# Altium project TASK1AE.PrjPcb
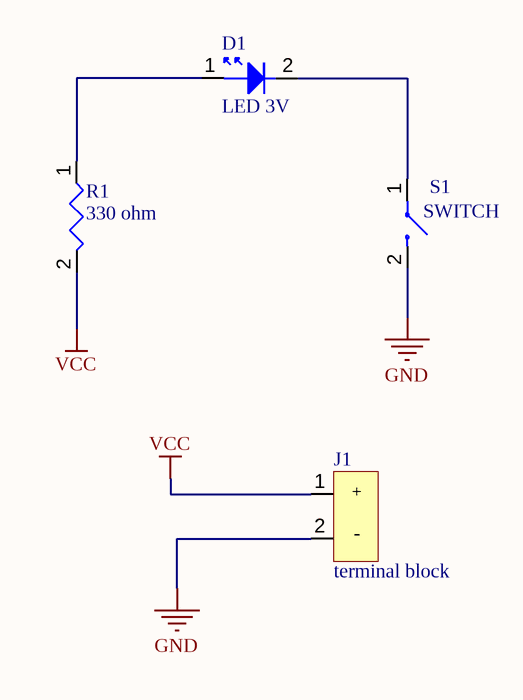
[diagram p0: circuit page19.SchDoc]
CAGE_CODE: ?????; CONTRACT_NUMBER: <CONTRACT NO>; DOC_NO_ASSY_DWG: <ASSY DWG NO>; DOC_NO_BOM: <BOM DOC NO>; DOC_NO_FAB_DWG: <FAB DWG NO>; DOC_NO_SCH_DWG: <SCH DWG NO>; PCB_2_DEC_TOL: +/-.01; PCB_3_DEC_TOL: +/-.010; PCB_ANG_TOL: +/-1/2; PCB_ASSEMBLY_NO: <PCB ASSY NO>; PCB_CHECKER: - -----; PCB_CHECKER_APP_DATE: --/--/----; PCB_DESIGNER: - -----; PCB_DESIGNER_APP_DATE: --/--/----; PCB_DWG_NO: <PCB DWG NO>; PCB_ENGINEER: - -----; PCB_ENGINEER_APP_DATE: --/--/----; PCB_PART_NUMBER: <PCB PN>; PCB_REV: A; SCH_REV: A
2 sheets, 10 parts. Net scope: global (net labels, ports and power ports of the same name join across sheets).
Board files: circuit page19.PcbDoc, 1ch motor drive.PcbDoc
Sheets:
  circuit page19.SchDoc
  1ch motor drive.SchDoc

## Sheet circuit page19.SchDoc
size 431 x 279 mm; SheetNumber: 1; SheetTotal: 1; ENG_APP_DATE: --/--/--; DSN_APP_DATE: --/--/--; CHK_APP_DATE: --/--/--

### Parts
D1  LED 3V  [led TH]
J1  terminal block  [header]
R1  330 ohm  [330ohm_TH]
S1  SWITCH  [DIP1]

### Nets
GND: J1.2 S1.2
VCC: J1.1 R1.2
NetD1_1: D1.1 R1.1
NetD1_2: D1.2 S1.1

### Notes on the sheet
- DWG. NO.
- REV.
- SHT.
- THIS DOCUMENT AND THE DATA DISCLOSED HEREIN OR HEREWITH IS THE PROPERTY OF ALTIUM LIMITED AND MAY BE FREELY DISTRIBUTED IN WHOLE. NO RIGHTS ARE RESERVED OR EXPRESS OR IMPLIED WARANTEE GIVEN.
- REVISION
- DESCRIPTION
- DATE
- APPROVED
- ENG:
- APPROVALS
- PROJECT
- DSN:
- CHK:
- REFERENCE DOCUMENTS
- PROJECT REVISION:
- TITLE
- DOCUMENT REVISION:
- DESIGN ITEM:
- BOM:
- FAB DWG:
- PCB DWG:
- ASSY DWG:
- SCALE:
- SIZE
- B
- CAGE CODE
- FILE NAME
- DWG NO.
- SHEET
- OF
- REV
- (in symbol terminal block_TH) +; -

### Library data of the parts
D1 = led_TH
J1 = terminal block_TH
R1 = resistor_TH: through hole resistor 330 ohm; Manufacturer: TE Connectivity Passive Product; Manufacturer Product Number: LR1F330R; tolerance: ±1%; power rating: 0.6W; package size: 2.30mm x 6.20mm; Packaging: Cut Tape (CT)
S1 = dip swith1_TH: DIP SWITCH; rated voltage: 24 50 Vdc; rated current: 25 100 Vdc; contact resistance: 50 100 mΩ; insulation resistance: 100 MΩ; withstanding voltage: 300 Vac; ComponentLink1Description: DATASHEET; ComponentLink1URL: https://www.cuidevices.com/product/resource/ds01-254.pdf

## Sheet 1ch motor drive.SchDoc
size A; SheetNumber: 2; SheetTotal: 2
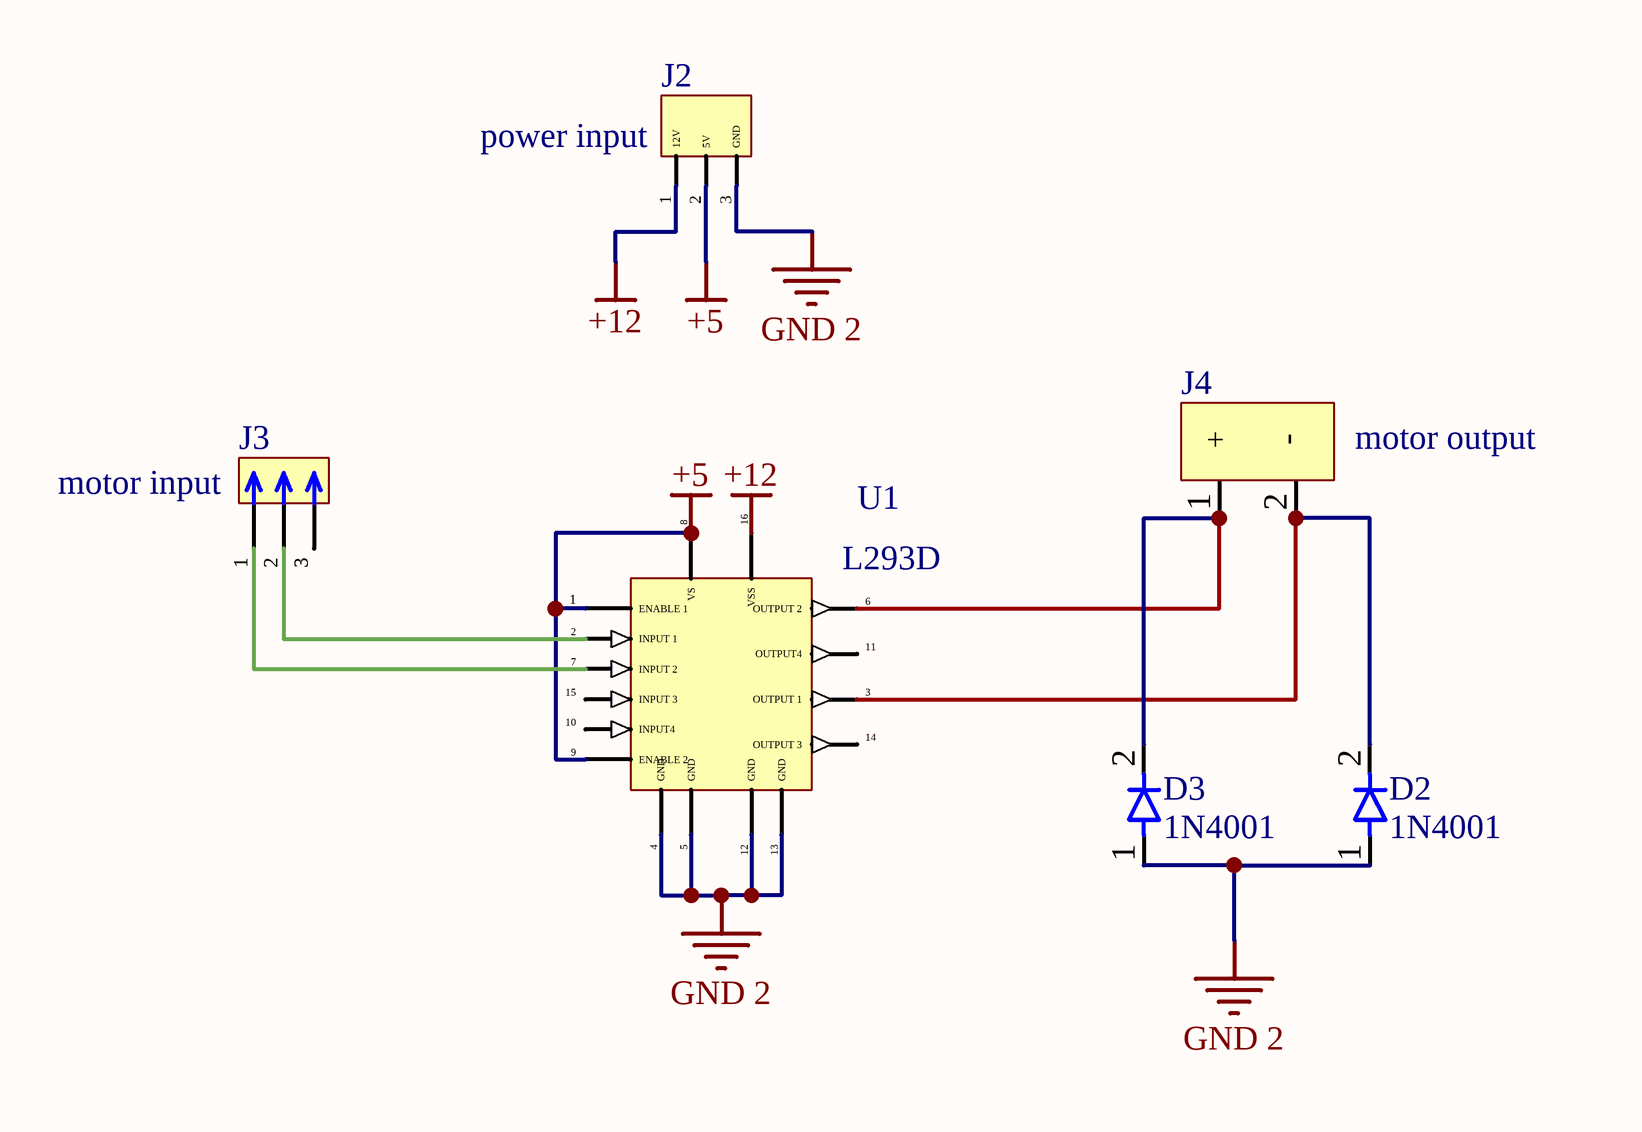
[diagram p1: 1ch motor drive.SchDoc]

### Parts
D2  1N4001  [330ohm_TH]
D3  1N4001  [330ohm_TH]
J2  power input  [TERMINAL BLOCK 3PIN]
J3  motor input  [pin header male]
J4  motor output  [header]
U1  L293D  [L293D]

### Nets
+5: J2.2(5V) U1.1(ENABLE_1) U1.8(VS) U1.9(ENABLE_2)
+12: J2.1(12V) U1.16(VSS)
GND 2: D2.1 D3.1 J2.3(GND) U1.4(GND) U1.5(GND) U1.12(GND) U1.13(GND)
NetD2_2: D2.2 J4.2 U1.3(OUTPUT_1)
NetD3_2: D3.2 J4.1 U1.6(OUTPUT_2)
NetJ3_1: J3.1 U1.7(INPUT_2)
NetJ3_2: J3.2 U1.2(INPUT_1)

Not connected (* = marked no-connect by the designer): J3 3; U1 10(INPUT4) 11(OUTPUT4) 14(OUTPUT_3) 15(INPUT_3)

### Notes on the sheet
- (in symbol terminal block_TH) -; +

### Library data of the parts
D2 D3 = diode: Forward Voltage: 1.1 V; Maximum Full Load Reverse Current,: 30 μA; Reverse Current at Rated V: 5.0 μA; Power Dissipation: 3.0 W
J2 = 3pin terminal block
J3 = pin header male
J4 = terminal block_TH